# EAGLE design acontrol (EAGLE 9.4.1)
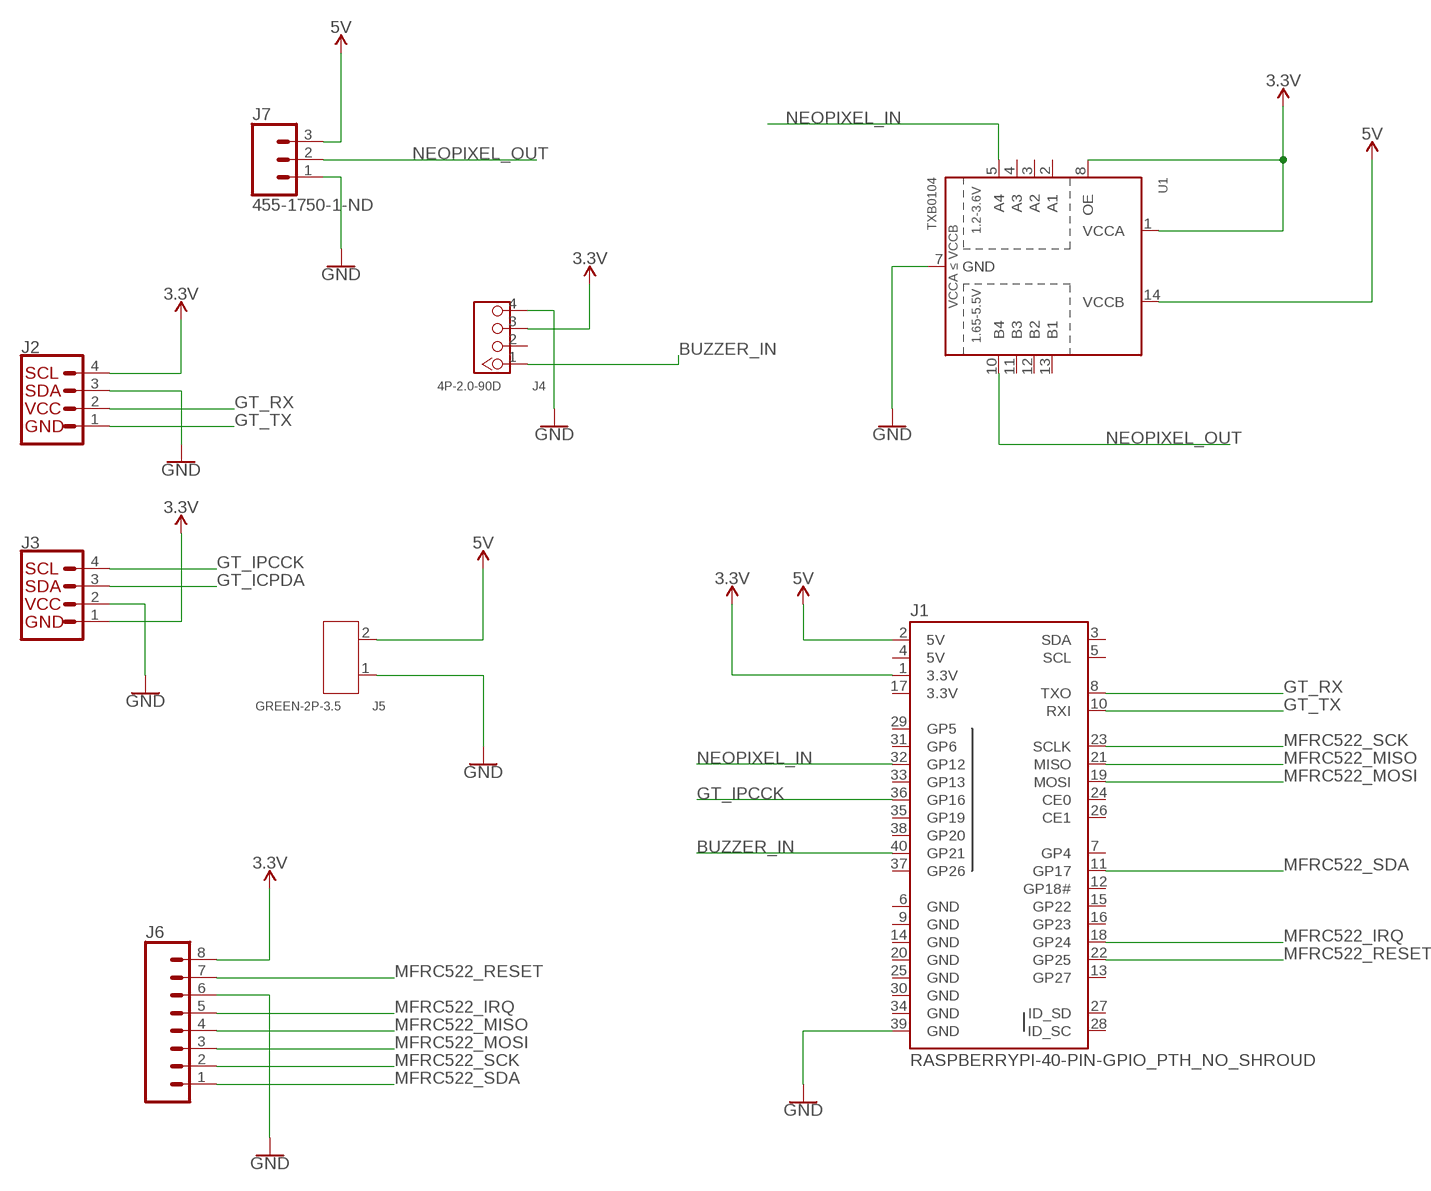
[diagram p0: schematic, sheet 1]

## Parts
J1  RASPBERRYPI-40-PIN-GPIO_PTH_NO_SHROUD  [2X20]
J2  QWIIC_CONNECTORJS-1MM  [JST04_1MM_RA]
J3  QWIIC_CONNECTORJS-1MM  [JST04_1MM_RA]
J4  4P-2.0-90D  GROVE-CONNECTOR-DIP-90D(4P-2.0)  [HW4-2.0-90D]
J5  GREEN-2P-3.5  SCREW-TERMINAL-GREEN(2P-3.5)  [H2-3.5-7.0X7.0MM]
J6  CONN_08"  [1X08]
J7  455-1750-1-ND  CONN_03  [1X03]
U1  TXB0104  TXB0104PWR  [TSSOP14]

## Nets
3.3V: J1.1(3.3V) J2.4 J3.1 J4.3 J6.8 U1.1(VCCA) U1.8(OE)
5V [5V]: J1.2(5V) J5.2 J7.3 U1.14(VCCB)
BUZZER_IN: J1.40(GP21) J4.1
GND [GND]: J1.39(GND) J2.3 J3.2 J4.4 J5.1 J6.6 J7.1 U1.7(GND)
GT_ICPDA: J3.3
GT_IPCCK: J1.36(GP16) J3.4
GT_RX: J1.8(TXO) J2.2
GT_TX: J1.10(RXI) J2.1
MFRC522_IRQ: J1.18(GP24) J6.5
MFRC522_MISO: J1.21(MISO) J6.4
MFRC522_MOSI: J1.19(MOSI) J6.3
MFRC522_RESET: J1.22(GP25) J6.7
MFRC522_SCK: J1.23(SCLK) J6.2
MFRC522_SDA: J1.11(GP17) J6.1
NEOPIXEL_IN: J1.32(GP12) U1.5(A4)
NEOPIXEL_OUT: J7.2 U1.10(B4)
Unconnected: J1.3(SDA) J1.5(SCL) J1.7(GP4) J1.12(GP18#) J1.13(GP27) J1.15(GP22) J1.16(GP23) J1.24(CE0) J1.26(CE1) J1.27(ID_SD) J1.28(ID_SC) J1.29(GP5) J1.31(GP6) J1.33(GP13) J1.35(GP19) J1.37(GP26) J1.38(GP20) J4.2 U1.2(A1) U1.3(A2) U1.4(A3) U1.11(B3) U1.12(B2) U1.13(B1)

## Power pins joined to a net without a drawn wire
3.3V: J1.17(3.3V)
5V: J1.4(5V)
GND: J1.6(GND) J1.9(GND) J1.14(GND) J1.20(GND) J1.25(GND) J1.30(GND) J1.34(GND)

## Library data of the parts
J1 = SparkFun-Connectors:RASPBERRYPI-40-PIN-GPIO: Raspberry Pi GPIO Header 2x20 pin connector, as found on B, B+, A+ models. Both shrouded PTH and SMT versions available. SparkFun Products: GPIO Shrouded Header <https://www.sparkfun.com/products/13054>- PTH SparkFun Pi Wedge (Preassembled) <https://www.sparkfun.com/products/13717>
J2 J3 = SparkFun-Connectors:QWIIC_CONNECTOR: SparkFun I2C Standard Qwiic Connector An SMD 1mm pitch JST connector makes it easy and quick (get it? Qwiic?) to connect I2C devices to each other. The Qwiic system <http://www.sparkfun.com/qwiic> enables fast and solderless connection between popular platforms and various sensors and actuators. We carry 200mm <https://www.sparkfun.com/products/14204>, 100mm <https://www.sparkfun.com/products/14205>, 50mm <https://www.sparkfun.com/products/14206>, and breadboard friendly <https://www.sparkfun.com/products/14207> Qwiic cables. We also offer 10 pcs strips <https://www.sparkfun.com/products/14323> the SMD connectors.; PROD_ID: CONN-13694
J4 = OPL_Connector:GROVE-CONNECTOR-DIP-90D(4P-2.0): 320110034
J5 = OPL_Connector:SCREW-TERMINAL-GREEN(2P-3.5): 320110028
J6 = SparkFun-Connectors:CONN_08: Multi connection point. Often used as Generic Header-pin footprint for 0.1 inch spaced/style header connections On any of the 0.1 inch spaced packages, you can populate with these: Break Away Headers - Straight <https://www.sparkfun.com/products/116> (PRT-00116) Break Away Male Headers - Right Angle <https://www.sparkfun.com/products/553> (PRT-00553) Female Headers <https://www.sparkfun.com/products/115> (PRT-00115) Break Away Headers - Machine Pin <https://www.sparkfun.com/products/117> (PRT-00117) Break Away Female Headers - Swiss Machine Pin <https://www.sparkfun.com/products/743> (PRT-00743) Arduino Stackable Header - 8 Pin <https://www.sparkfun.com/products/9279> (PRT-09279) For SCREWTERMINALS and SPRING TERMINALS visit here: Screw Terimnals on SparkFun.com <https://www.sparkfun.com/search/results?term=Screw+Terminals> (5mm/3.5mm/2.54mm spacing) This device is also useful as a general connection point to wire up your design to another part of your project. Our various solder wires solder well into these plated through hole pads. Hook-Up Wire - Assortment (Stranded, 22 AWG) <https://www.sparkfun.com/products/11375> (PRT-11375) Hook-Up Wire - Assortment (Solid Core, 22 AWG) <https://www.sparkfun.com/products/11367> (PRT-11367) View the entire wire category on our website here <https://www.sparkfun.com/categories/141> Special notes: Molex polarized connector foot print use with SKU : PRT-08231 with associated crimp pins and housings. 1MM SMD Version SKU: PRT-10208 NOTES ON THE VARIANTS LOCK and LOCK_LONGPADS... This footprint was designed to help hold the alignment of a through-hole component (i.e. 6-pin header) while soldering it into place. You may notice that each hole has been shifted either up or down by 0.005 of an inch from it's more standard position (which is a perfectly straight line). This slight alteration caused the pins (the squares in the middle) to touch the edges of the holes. Because they are alternating, it causes a "brace" to hold the component in place. 0.005 has proven to be the perfect amount of "off-center" position when using our standard breakaway headers. Although looks a little odd when you look at the bare footprint, once you have a header in there, the alteration is very hard to notice. Also,if you push a header all the way into place, it is covered up entirely on the bottom side.; PROD_ID: CONN-08438
J7 = SparkFun-Connectors:CONN_03: Multi connection point. Often used as Generic Header-pin footprint for 0.1 inch spaced/style header connections On any of the 0.1 inch spaced packages, you can populate with these: Break Away Headers - Straight <https://www.sparkfun.com/products/116> (PRT-00116) Break Away Male Headers - Right Angle <https://www.sparkfun.com/products/553> (PRT-00553) Female Headers <https://www.sparkfun.com/products/115> (PRT-00115) Break Away Headers - Machine Pin <https://www.sparkfun.com/products/117> (PRT-00117) Break Away Female Headers - Swiss Machine Pin <https://www.sparkfun.com/products/743> (PRT-00743) Stackable Header - 3 Pin (Female, 0.1") <https://www.sparkfun.com/products/13875> (PRT-13875) For SCREWTERMINALS and SPRING TERMINALS visit here: Screw Terimnals on SparkFun.com <https://www.sparkfun.com/search/results?term=Screw+Terminals> (5mm/3.5mm/2.54mm spacing) This device is also useful as a general connection point to wire up your design to another part of your project. Our various solder wires solder well into these plated through hole pads. Hook-Up Wire - Assortment (Stranded, 22 AWG) <https://www.sparkfun.com/products/11375> (PRT-11375) Hook-Up Wire - Assortment (Solid Core, 22 AWG) <https://www.sparkfun.com/products/11367> (PRT-11367) View the entire wire category on our website here <https://www.sparkfun.com/categories/141> Special notes: Molex polarized connector foot print use with SKU : PRT-08232 with associated crimp pins and housings.; PROD_ID: XXX-00000
U1 = SparkFun-IC-Comms:TXB0104PWR: 4-Bit Bi-Directional Level Shifter 1.2V-3.6V (VCCA) to 1.65V-5.5V (VCCB) bi-directional level shifter with auto direction sensing. Max data rate - VCCA 1.8V: 20Mbps (50ns), VCCA 3.3V: 100Mbps (10ns) Digikey: 296-21929-1-ND (TSSOP) Datasheet <http://cdn.sparkfun.com/datasheets/BreakoutBoards/txb0104.pdf> SparkFun Products SparkFun Cellular Shield - MG2639 <https://www.sparkfun.com/products/13120> (CEL-13120) SparkFun Level Shifting microSD Breakout <https://www.sparkfun.com/products/13743> (DEV-13743) SparkFun Voltage-Level Translator Breakout - TXB0104 <https://www.sparkfun.com/products/11771> (BOB-11771) SparkFun Block for Intel® Edison - UART <https://www.sparkfun.com/products/13040> (DEV-13040) SparkFun Block for Intel® Edison - Arduino <https://www.sparkfun.com/products/13036> (DEV-13036); PROD_ID: IC-13929

## Net classes
1 5V: width 0.254 mm
2 GND: width 0.254 mm

## Board
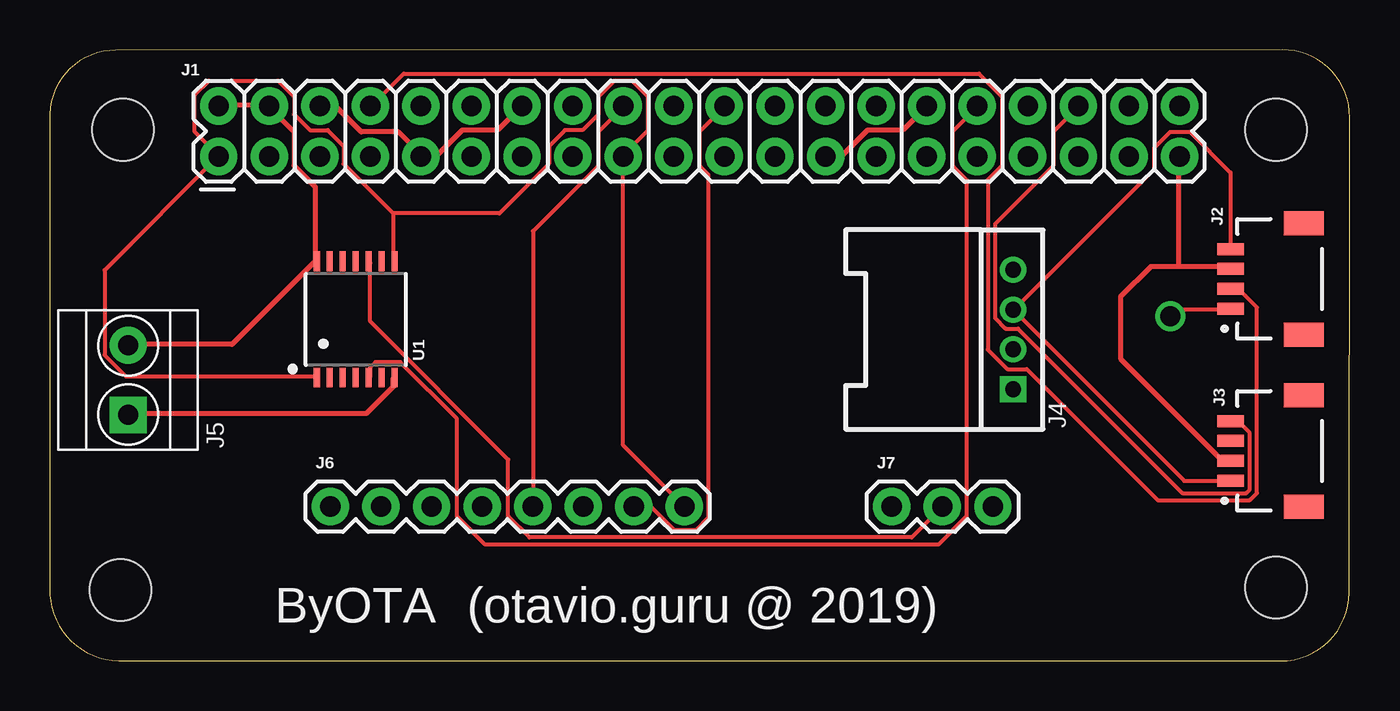
[diagram p1: board, top side]
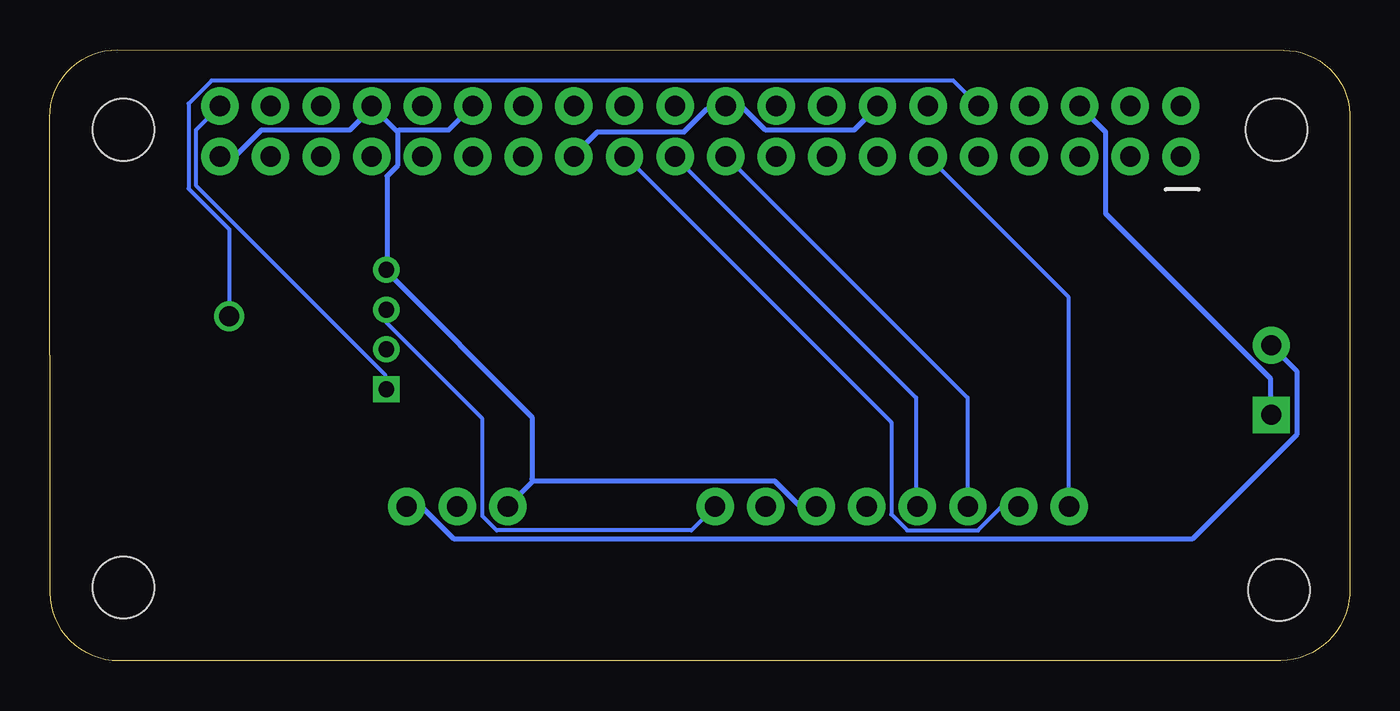
[diagram p2: board, bottom side, seen from below]

Size 65.29 x 30.68 mm. Coordinates in mm from the lower left corner, seen from the top.
Outline: 0,27.46 0,3.66 arc90 3.46,0 61.83,0 arc90 65.26,3.43 65.29,27.29 arc90 61.9,30.68 3.32,30.66 arc88 0,27.46
Copper layers (1*16): Top 0.035mm / dielectric 1.5mm / Bottom 0.035mm
Design rules "default *": minimum track width 8mil, minimum drill 1mm, track to track 6mil, track to pad 6mil, pad to pad 6mil, via to via 60mil, smd to smd 6mil, copper to edge 40mil, drill to drill 6mil, minimum pad ring 10mil, minimum via ring 8mil, stop-mask expansion 4mil, vias tented up to drill 0mil, thermal gap 10mil
Holes 3.1 mm at 3.68,26.67 3.56,3.56 61.59,26.67 61.59,3.68
tRestrict: area 0.9,23.9 to 6.5,29.5; area 0.8,0.5 to 6.3,6.1; area 58.8,0.8 to 64.4,6.4; area 58.8,23.7 to 64.4,29.3
bRestrict: area 0.9,23.9 to 6.5,29.5; area 0.8,0.5 to 6.3,6.1; area 58.8,0.8 to 64.4,6.4; area 58.8,23.7 to 64.4,29.3

### Footprints (pad centres in the part's own frame; a part is rotated, then mirrored left to right if it is on the bottom)
2X20 = drill 1.016 pad 1.88: 1 0,0; 2 0,2.54; 3 2.54,0; 4 2.54,2.54; 5 5.08,0; 6 5.08,2.54; 7 7.62,0; 8 7.62,2.54; 9 10.16,0; 10 10.16,2.54; 11 12.7,0; 12 12.7,2.54; 13 15.24,0; 14 15.24,2.54; 15 17.78,0; 16 17.78,2.54; 17 20.32,0; 18 20.32,2.54; 19 22.86,0; 20 22.86,2.54; 21 25.4,0; 22 25.4,2.54; 23 27.94,0; 24 27.94,2.54; 25 30.48,0; 26 30.48,2.54; 27 33.02,0; 28 33.02,2.54; 29 35.56,0; 30 35.56,2.54; 31 38.1,0; 32 38.1,2.54; 33 40.64,0; 34 40.64,2.54; 35 43.18,0; 36 43.18,2.54; 37 45.72,0; 38 45.72,2.54; 39 48.26,0; 40 48.26,2.54
JST04_1MM_RA = smd 0.6 x 1.35: 1 -1.5,0; 2 -0.5,0; 3 0.5,0; 4 1.5,0 | smd 1.2 x 2: NC1 2.8,-3.675; NC2 -2.8,-3.675
HW4-2.0-90D = drill 0.8 pad 1.27 square: 1 -3,0 | drill 0.8 pad 1.27: 2 -1,0; 3 1,0; 4 3,0
H2-3.5-7.0X7.0MM = drill 1 pad 1.85 square: 1 -1.75,0 | drill 1 pad 1.85: 2 1.75,0
1X08 = drill 1.016 pad 1.88: 1 0,0; 2 2.54,0; 3 5.08,0; 4 7.62,0; 5 10.16,0; 6 12.7,0; 7 15.24,0; 8 17.78,0
1X03 = drill 1.016 pad 1.88: 1 0,0; 2 2.54,0; 3 5.08,0
TSSOP14 = smd 0.305 x 0.991: 1 -1.95,-2.918; 2 -1.3,-2.918; 3 -0.65,-2.918; 4 0,-2.918; 5 0.65,-2.918; 6 1.3,-2.918; 7 1.95,-2.918; 8 1.95,2.918; 9 1.3,2.918; 10 0.65,2.918; 11 0,2.918; 12 -0.65,2.918; 13 -1.3,2.918; 14 -1.95,2.918

### Placement (x,y rotation side)
J1  8.48,25.32 0 top
J2  59.31,19.18 90 top
J3  59.31,10.54 90 top
J4  48.39,16.64 90 top
J5  3.94,14.1 90 top
J6  14.1,7.75 0 top
J7  42.29,7.75 0 top
U1  15.37,17.15 0 top

### Tracks (layer width: path | path; a pad name or v marks a point on that pad's centre or on a via)
3.3V
  Top 0.203: J3.1 59.3,9.04 56.98,9.04 48.45,17.58 J4.3 48.45,17.67 55.47,24.69 55.47,25.76 56.27,26.56 57.25,26.56 59.3,24.51 59.3,20.69 J2.4 | U1.1 13.33,14.29 3.82,14.29 2.76,15.35 2.76,19.62 8.44,25.31 J1.1 8.44,25.4 7.29,26.56 7.29,28.42 8,29.13 11.47,29.13 12.27,28.33 12.27,27.45 13.07,26.65 13.96,26.65 14.76,25.85 14.76,24.96 17.25,22.47 | 17.25,22.47 17.25,20.07 U1.8 | J6.8 28.8,10.82 J1.17 28.8,25.4 30.05,26.65 30.05,28.33 29.25,29.13 28.36,29.13 27.56,28.33 27.56,27.45 26.76,26.65 25.87,26.65 25.07,25.85 25.07,24.96 22.58,22.47 17.25,22.47
  Bottom 0.203: J6.8 33.07,6.55 42.85,6.55 43.56,7.26 43.56,12.15 48.36,16.95 48.36,17.58 J4.3
5V
  Top 0.254: 13.33,20.07 13.33,23.8 12.27,24.87 12.27,26.56 11.02,27.8 J1.4 10.93,27.89 8.53,27.89 J1.2 | 13.33,20.07 U1.14 | 13.33,20.07 9.16,15.89 4,15.89 J5.2
  Bottom 0.254: J7.3 47.29,7.71 46.58,7.71 44.98,6.11 7.91,6.11 2.67,11.35 2.67,14.55 3.91,15.8 J5.2
BUZZER_IN
  Bottom 0.203: J1.40 57.96,26.65 57.96,23.89 48.45,14.38 48.45,13.67 J4.1
GND
  Top 0.254: U1.7 17.25,14.2 17.25,13.75 15.91,12.42 4,12.42 J5.1 | J1.14 23.65,27.8 22.49,26.65 20.71,26.65 19.47,25.4 18.67,25.4 J1.9 18.58,25.49 17.51,26.56 15.65,26.56 14.4,27.8 13.6,27.8 J1.6 | 56.72,19.8 59.21,19.8 59.3,19.71 J2.3 | 56.72,19.8 55.3,19.8 53.78,18.29 53.78,15.18 58.85,10.11 59.3,10.11 J3.2 | 56.72,19.8 56.72,25.31 J1.39 | J1.25 39.03,25.4 39.83,25.4 41.07,26.65 42.85,26.65 44,27.8 J1.30
  Bottom 0.254: J1.14 23.74,27.8 24.89,26.65 29.34,26.65 30.49,27.8 31.29,27.8 J1.20 31.38,27.71 32.27,27.71 33.43,26.56 37.78,26.56 38.94,25.4 J1.25 | J5.1 4,12.42 4,14.2 12.27,22.47 12.27,26.56 13.51,27.8 J1.6 | 40.98,9.04 28.89,9.04 27.65,7.8 26.85,7.8 J6.6 | 40.98,9.04 42.23,7.8 J7.1 | 47.83,26.56 47.83,24.87 48.36,24.33 48.36,19.71 J4.4 48.36,19.53 41.07,12.24 41.07,9.13 40.98,9.04 | 47.83,26.56 49.07,27.8 J1.34 49.16,27.71 50.23,26.65 54.67,26.65 55.92,25.4 56.72,25.4 J1.39 | 47.83,26.56 47.74,26.65 45.25,26.65 44.09,27.8 J1.30
GT_IPCCK
  Top 0.203: J3.4 59.38,11.98 59.74,11.98 60.27,11.44 60.27,8.6 60.1,8.42 56.9,8.42 48.63,16.69 48.01,16.69 47.47,17.22 47.47,21.93 50.41,24.87 50.41,26.56 51.65,27.8 J1.36
GT_RX
  Top 0.203: J2.2 59.38,18.64 59.74,18.64 60.63,17.76 60.63,8.42 60.27,8.06 55.65,8.06 49.07,14.64 48.09,14.64 47.12,15.62 47.12,24.16 47.83,24.87 47.83,28.33 46.67,29.49 17.78,29.49 16.18,27.89 J1.8
GT_TX  (via drill 1)
  Top 0.203: v56.27,17.31 56.63,17.67 59.3,17.67 J2.1
  Bottom 0.203: v56.27,17.31 56.27,21.67 58.32,23.71 58.32,27.98 57.16,29.13 19.91,29.13 J1.10
MFRC522_IRQ
  Top 0.203: J6.5 24.27,7.8 24.27,21.58 27.56,24.87 27.56,26.56 28.8,27.8 J1.18
MFRC522_MISO
  Bottom 0.203: J1.21 21.78,13.22 21.78,7.8 J6.4
MFRC522_MOSI
  Bottom 0.203: J6.3 19.2,7.8 19.2,13.22 31.29,25.31 J1.19
MFRC522_RESET
  Top 0.203: J6.7 29.34,7.71 30.23,7.71 31.38,6.55 32.45,6.55 33.07,7.18 33.07,24.42 32.63,24.87 32.63,26.56 33.87,27.8 J1.22
MFRC522_SCK
  Bottom 0.203: J6.2 16.71,7.71 17.51,7.71 18.67,6.55 22.22,6.55 23.02,7.35 23.02,11.98 36.36,25.31 J1.23
MFRC522_SDA
  Bottom 0.203: J6.1 14.13,7.8 14.13,18.29 21.16,25.31 J1.11
NEOPIXEL_IN
  Top 0.203: U1.5 16.09,14.29 16.09,14.73 16.36,15 17.6,15 20.45,12.15 20.45,7.26 21.87,5.84 44.63,5.84 46.05,7.26 46.05,24.16 45.34,24.87 45.34,26.56 46.58,27.8 J1.32
NEOPIXEL_OUT
  Top 0.203: U1.10 16.09,19.98 16.09,17.04 23.02,10.11 23.02,7.26 24.09,6.2 43.29,6.2 44.81,7.71 J7.2

### Text on the board
tNames: ByOTA | (otavio.guru @ 2019)